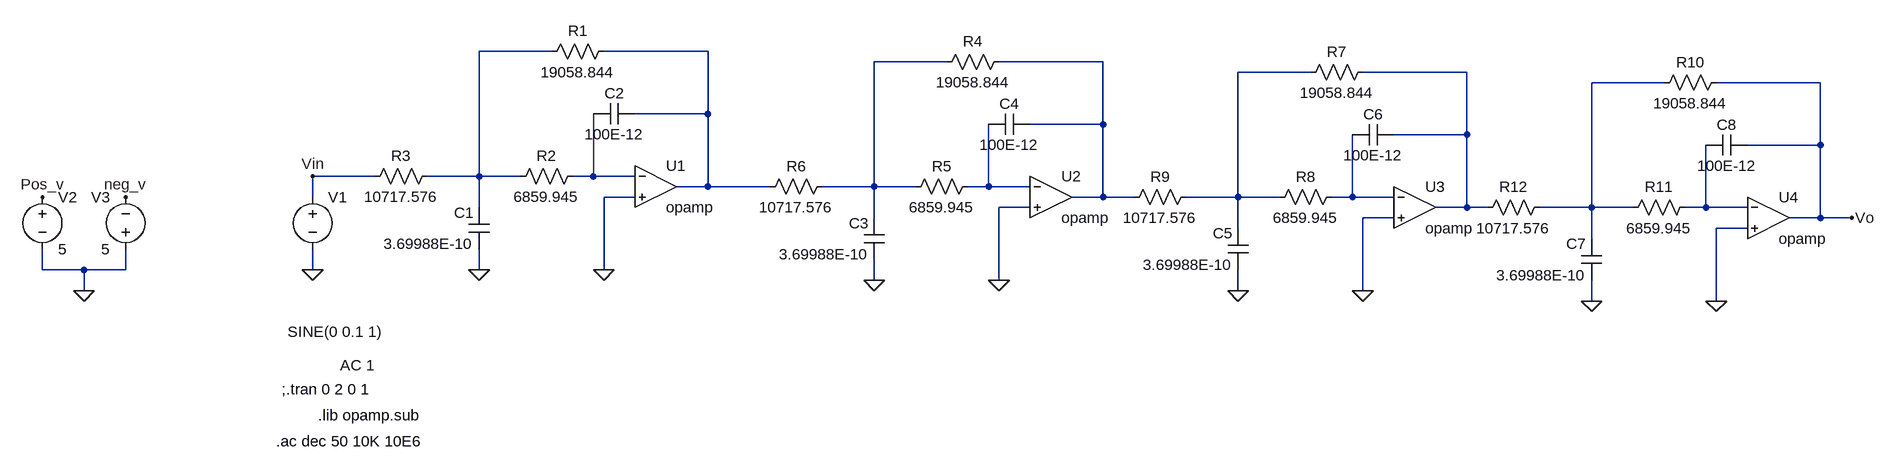
[diagram p0: schematic Cascade.asc]
Cascade.asc, the LTspice schematic file:
Version 4
SHEET 1 2676 680
WIRE -64 0 -176 0
WIRE 176 0 16 0
WIRE 544 16 432 16
WIRE 784 16 624 16
WIRE 1104 32 992 32
WIRE 1344 32 1184 32
WIRE 1648 48 1536 48
WIRE 1888 48 1728 48
WIRE 176 96 176 0
WIRE 176 96 64 96
WIRE 784 112 784 16
WIRE 784 112 672 112
WIRE 1344 128 1344 32
WIRE 1344 128 1232 128
WIRE 1888 144 1888 48
WIRE 1888 144 1776 144
WIRE -336 192 -432 192
WIRE -176 192 -176 0
WIRE -176 192 -256 192
WIRE -112 192 -176 192
WIRE 0 192 0 96
WIRE 0 192 -32 192
WIRE 64 192 0 192
WIRE 176 208 176 96
WIRE 176 208 128 208
WIRE 272 208 176 208
WIRE 432 208 432 16
WIRE 432 208 352 208
WIRE 496 208 432 208
WIRE 608 208 608 112
WIRE 608 208 576 208
WIRE 672 208 608 208
WIRE -432 224 -432 192
WIRE 64 224 16 224
WIRE 784 224 784 112
WIRE 784 224 736 224
WIRE 832 224 784 224
WIRE 992 224 992 32
WIRE 992 224 912 224
WIRE 1056 224 992 224
WIRE 1168 224 1168 128
WIRE 1168 224 1136 224
WIRE 1232 224 1168 224
WIRE -176 240 -176 192
WIRE 672 240 624 240
WIRE 1344 240 1344 128
WIRE 1344 240 1296 240
WIRE 1376 240 1344 240
WIRE 1536 240 1536 48
WIRE 1536 240 1456 240
WIRE 1600 240 1536 240
WIRE 1712 240 1712 144
WIRE 1712 240 1680 240
WIRE 1776 240 1712 240
WIRE 432 256 432 208
WIRE 1232 256 1184 256
WIRE 1888 256 1888 144
WIRE 1888 256 1840 256
WIRE 1936 256 1888 256
WIRE 992 272 992 224
WIRE 1776 272 1728 272
WIRE 1536 288 1536 240
WIRE -848 336 -848 304
WIRE -784 336 -848 336
WIRE -720 336 -720 304
WIRE -720 336 -784 336
WIRE -432 336 -432 304
WIRE -176 336 -176 304
WIRE 16 336 16 224
WIRE 432 352 432 320
WIRE 624 352 624 240
WIRE -784 368 -784 336
WIRE 992 368 992 336
WIRE 1184 368 1184 256
WIRE 1536 384 1536 352
WIRE 1728 384 1728 272
FLAG -848 224 Pos_v
FLAG -720 224 neg_v
FLAG -784 368 0
FLAG 16 336 0
FLAG -176 336 0
FLAG -432 336 0
FLAG -432 192 Vin
FLAG 624 352 0
FLAG 432 352 0
FLAG 1184 368 0
FLAG 992 368 0
FLAG 1728 384 0
FLAG 1536 384 0
FLAG 1936 256 Vo
SYMBOL voltage -848 208 R0
WINDOW 123 0 0 Left 0
WINDOW 39 0 0 Left 0
SYMATTR InstName V2
SYMATTR Value 5
SYMBOL voltage -720 320 R180
WINDOW 0 24 96 Left 2
WINDOW 3 24 16 Left 2
WINDOW 123 0 0 Left 0
WINDOW 39 0 0 Left 0
SYMATTR InstName V3
SYMATTR Value 5
SYMBOL res 32 -16 R90
WINDOW 0 0 56 VBottom 2
WINDOW 3 32 56 VTop 2
SYMATTR InstName R1
SYMATTR Value 19058.844
SYMBOL res -16 176 R90
WINDOW 0 0 56 VBottom 2
WINDOW 3 32 56 VTop 2
SYMATTR InstName R2
SYMATTR Value 6859.945
SYMBOL res -240 176 R90
WINDOW 0 0 56 VBottom 2
WINDOW 3 32 56 VTop 2
SYMATTR InstName R3
SYMATTR Value 10717.576
SYMBOL cap -160 304 R180
WINDOW 0 24 56 Left 2
WINDOW 3 24 8 Left 2
SYMATTR InstName C1
SYMATTR Value 3.69988E-10
SYMBOL cap 0 112 R270
WINDOW 0 32 32 VTop 2
WINDOW 3 0 32 VBottom 2
SYMATTR InstName C2
SYMATTR Value 100E-12
SYMBOL voltage -432 208 R0
WINDOW 123 42 275 Left 2
WINDOW 39 0 0 Left 0
WINDOW 3 -39 223 Left 2
SYMATTR Value2 AC 1
SYMATTR Value SINE(0 0.1 1)
SYMATTR InstName V1
SYMBOL res 640 0 R90
WINDOW 0 0 56 VBottom 2
WINDOW 3 32 56 VTop 2
SYMATTR InstName R4
SYMATTR Value 19058.844
SYMBOL res 592 192 R90
WINDOW 0 0 56 VBottom 2
WINDOW 3 32 56 VTop 2
SYMATTR InstName R5
SYMATTR Value 6859.945
SYMBOL res 368 192 R90
WINDOW 0 0 56 VBottom 2
WINDOW 3 32 56 VTop 2
SYMATTR InstName R6
SYMATTR Value 10717.576
SYMBOL cap 448 320 R180
WINDOW 0 24 56 Left 2
WINDOW 3 24 8 Left 2
SYMATTR InstName C3
SYMATTR Value 3.69988E-10
SYMBOL cap 608 128 R270
WINDOW 0 32 32 VTop 2
WINDOW 3 0 32 VBottom 2
SYMATTR InstName C4
SYMATTR Value 100E-12
SYMBOL res 1200 16 R90
WINDOW 0 0 56 VBottom 2
WINDOW 3 32 56 VTop 2
SYMATTR InstName R7
SYMATTR Value 19058.844
SYMBOL res 1152 208 R90
WINDOW 0 0 56 VBottom 2
WINDOW 3 32 56 VTop 2
SYMATTR InstName R8
SYMATTR Value 6859.945
SYMBOL res 928 208 R90
WINDOW 0 0 56 VBottom 2
WINDOW 3 32 56 VTop 2
SYMATTR InstName R9
SYMATTR Value 10717.576
SYMBOL cap 1008 336 R180
WINDOW 0 24 56 Left 2
WINDOW 3 24 8 Left 2
SYMATTR InstName C5
SYMATTR Value 3.69988E-10
SYMBOL cap 1168 144 R270
WINDOW 0 32 32 VTop 2
WINDOW 3 0 32 VBottom 2
SYMATTR InstName C6
SYMATTR Value 100E-12
SYMBOL res 1744 32 R90
WINDOW 0 0 56 VBottom 2
WINDOW 3 32 56 VTop 2
SYMATTR InstName R10
SYMATTR Value 19058.844
SYMBOL res 1696 224 R90
WINDOW 0 0 56 VBottom 2
WINDOW 3 32 56 VTop 2
SYMATTR InstName R11
SYMATTR Value 6859.945
SYMBOL res 1472 224 R90
WINDOW 0 0 56 VBottom 2
WINDOW 3 32 56 VTop 2
SYMATTR InstName R12
SYMATTR Value 10717.576
SYMBOL cap 1552 352 R180
WINDOW 0 24 56 Left 2
WINDOW 3 24 8 Left 2
SYMATTR InstName C7
SYMATTR Value 3.69988E-10
SYMBOL cap 1712 160 R270
WINDOW 0 32 32 VTop 2
WINDOW 3 0 32 VBottom 2
SYMATTR InstName C8
SYMATTR Value 100E-12
SYMBOL Opamps\\opamp 96 144 R0
SYMATTR InstName U1
SYMBOL Opamps\\opamp 704 160 R0
SYMATTR InstName U2
SYMBOL Opamps\\opamp 1264 176 R0
SYMATTR InstName U3
SYMBOL Opamps\\opamp 1808 192 R0
SYMATTR InstName U4
TEXT -488 600 Left 2 !.ac dec 50 10K 10E6
TEXT -480 520 Left 2 !;.tran 0 2 0 1
TEXT -424 560 Left 2 !.lib opamp.sub

The netlist it stands for:
* Cascade.asc
V2 Pos_v 0 5
V3 0 neg_v 5
R1 N002 N001 19058.844
R2 N008 N001 6859.945
R3 N001 Vin 10717.576
C1 0 N001 3.69988E-10
C2 N008 N002 100E-12
V1 Vin 0 SINE(0 0.1 1) AC 1
R4 N004 N003 19058.844
R5 N009 N003 6859.945
R6 N003 N002 10717.576
C3 0 N003 3.69988E-10
C4 N009 N004 100E-12
R7 N006 N005 19058.844
R8 N010 N005 6859.945
R9 N005 N004 10717.576
C5 0 N005 3.69988E-10
C6 N010 N006 100E-12
R10 Vo N007 19058.844
R11 N011 N007 6859.945
R12 N007 N006 10717.576
C7 0 N007 3.69988E-10
C8 N011 Vo 100E-12
XU1 N008 0 N002 opamp Aol=100K GBW=10Meg  ; pins invin noninvin out
XU2 N009 0 N004 opamp Aol=100K GBW=10Meg  ; pins invin noninvin out
XU3 N010 0 N006 opamp Aol=100K GBW=10Meg  ; pins invin noninvin out
XU4 N011 0 Vo opamp Aol=100K GBW=10Meg  ; pins invin noninvin out
.ac dec 50 10K 10E6
;.tran 0 2 0 1
.lib opamp.sub
.backanno
.end